# Altium schematic sheet Strain_sensor.SchDoc: Smartknob Strain Sensor
size A3; DrawnBy: Mani Magnusson; Revision: 1; SheetNumber: 5; SheetTotal: 5
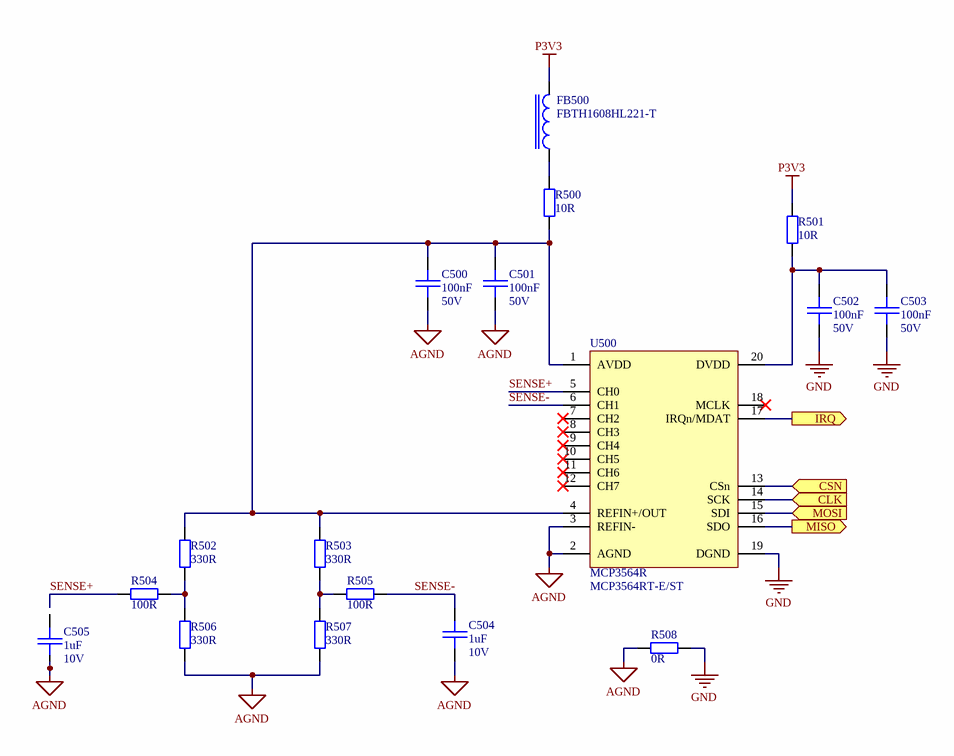
[diagram p0: Strain_sensor.SchDoc]

## Parts
C500  value 100nF  Voltage: 50V  [C0402]  (hidden comment: CAP)
C501  value 100nF  Voltage: 50V  [C0402]  (hidden comment: CAP)
C502  value 100nF  Voltage: 50V  [C0402]  (hidden comment: CAP)
C503  value 100nF  Voltage: 50V  [C0402]  (hidden comment: CAP)
C504  value 1uF  Voltage: 10V  [C0402]  (hidden comment: CAP)
C505  value 1uF  Voltage: 10V  [C0402]  (hidden comment: CAP)
FB500  Manufacturer Part No: FBTH1608HL221-T  [0603_IND]  (hidden comment: FBEAD)
R500  value 10R  [R0603]  (hidden comment: RES)
R501  value 10R  [R0603]  (hidden comment: RES)
R502  value 330R  [R2512]  (hidden comment: RES)
R503  value 330R  [R2512]  (hidden comment: RES)
R504  value 100R  [R0603]  (hidden comment: RES)
R505  value 100R  [R0603]  (hidden comment: RES)
R506  value 330R  [R2512]  (hidden comment: RES)
R507  value 330R  [R2512]  (hidden comment: RES)
R508  value 0R  [R0402]  (hidden comment: RES)
U500  MCP3564R  Manufacturer Part No: MCP3564RT-E/ST  [20-TSSOP]

## Ports
CLK (in), CSN (in), IRQ (out), MISO (out), MOSI (in)

## Nets
AGND: C500.2 C501.2 C504.2 C505.2 R506.1 R507.1 R508.1 U500.2(AGND) U500.3(REFIN-)
GND: C502.2 C503.2 R508.2 U500.19(DGND)
P3V3: FB500.2 R501.2
CLK: U500.14(SCK) ; port CLK
CSN: U500.13(CSn) ; port CSN
IRQ: U500.17(IRQn/MDAT) ; port IRQ
MISO: U500.16(SDO) ; port MISO
MOSI: U500.15(SDI) ; port MOSI
SENSE+: R504.1 U500.5(CH0)
SENSE-: C504.1 R505.2 U500.6(CH1)
NetC500_1: C500.1 C501.1 R500.1 R502.2 R503.2 U500.1(AVDD) U500.4(REFIN+/OUT)
NetC502_1: C502.1 C503.1 R501.1 U500.20(DVDD)
NetFB500_1: FB500.1 R500.2
NetR502_1: R502.1 R504.2 R506.2
NetR503_1: R503.1 R505.1 R507.2

Not connected (* = marked no-connect by the designer): C505 1; U500 7(CH2)* 8(CH3)* 9(CH4)* 10(CH5)* 11(CH6)* 12(CH7)* 18(MCLK)*

## Notes on the sheet
- Sheet title:
- Revision:
- Drawn by:
- Date:
- File:

## Library data of the parts
C500-C503 = GRT155R71H104KE01D: General purpose ceramic capacitor; Manufacturer: Murata Electronics; Specification: X7R, 50V, AEC-Q200 Qualified; Ready for use: y; Fitted: Fitted; Package Ref: C0402; Part Reference: GRT155R71H104KE01D; Manufacturer Part No: GRT155R71H104KE01D; Supplier: Digi-Key; Supplier Part No: 490-GRT155R71H104KE01DCT-ND; Generic: Generic
C504 C505 = GRT155R61A105KE01D: General purpose ceramic capacitor; Manufacturer: Murata Electronics; Specification: X5R, 10V, AEC-Q200 Qualified; Ready for use: y; Fitted: Fitted; Package Ref: C0402; Part Reference: GRT155R61A105KE01D; Manufacturer Part No: GRT155R61A105KE01D; Supplier: Digi-Key; Supplier Part No: 490-GRT155R61A105KE01DCT-ND; Generic: Generic
FB500 = FBTH1608HL221-T: Ferrite bead; Manufacturer: Taiyo Yuden; Specification: 650mA max, AEC-Q200 Qualified; Ready for use: y; Fitted: Fitted; Package Ref: 0603_IND; Part Reference: FBTH1608HL221-T; Supplier: Digi-Key; Supplier Part No: 587-FBTH1608HL221-TCT-ND; Generic: Generic
R500 R501 = CRCW060310R0JNEA: General purpose automotive thick film resistor; Manufacturer: Vishay Dale; Specification: 5%, 200ppm, 0.1W, AEC-Q200 Qualified; Ready for use: y; Fitted: Fitted; Package Ref: R0603; Part Reference: CRCW060310R0JNEA; Manufacturer Part No: CRCW060310R0JNEA; Supplier: Digi-Key; Supplier Part No: 541-10GCT-ND; Generic: Generic
R502 R503 R506 R507 = CRCW2512330RJNEG: General purpose automotive thick film resistor; Manufacturer: Vishay Dale; Specification: 5%, 200ppm, 1W, AEC-Q200 Qualified; Ready for use: y; Fitted: Fitted; Package Ref: R2512; Part Reference: CRCW2512330RJNEG; Manufacturer Part No: CRCW2512330RJNEG; Supplier: Digi-Key; Supplier Part No: 541-330XCT-ND; Generic: Generic
R504 R505 = CRCW0603100RJNEA: General purpose automotive thick film resistor; Manufacturer: Vishay Dale; Specification: 5%, 200ppm, 0.1W, AEC-Q200 Qualified; Ready for use: y; Fitted: Fitted; Package Ref: R0603; Part Reference: CRCW0603100RJNEA; Manufacturer Part No: CRCW0603100RJNEA; Supplier: Digi-Key; Supplier Part No: 541-100GCT-ND; Generic: Generic
R508 = Generic 0402 resistor: General purpose resistor; Manufacturer Part No: Generic resistor; Ready for use: y; Fitted: Fitted; Package Ref: R0402; Part Reference: Generic 0402 resistor; Manufacturer: N/A; Supplier: N/A; Supplier Part No: N/A; Generic: Generic
U500 = MCP3564RT-E/ST: Low-noise 24-bit Delta-Sigma ADC, 2/4/8 ch single ended, 1/2/4 ch differential; Manufacturer: Microchip Technology; Generic: Non Generic; Ready for use: y; Fitted: Fitted; Package Ref: 20-TSSOP; Part Reference: MCP3564RT-E/ST; Supplier: Digi-Key; Supplier Part No: 150-MCP3564RT-E/STCT-ND; Type: ADC